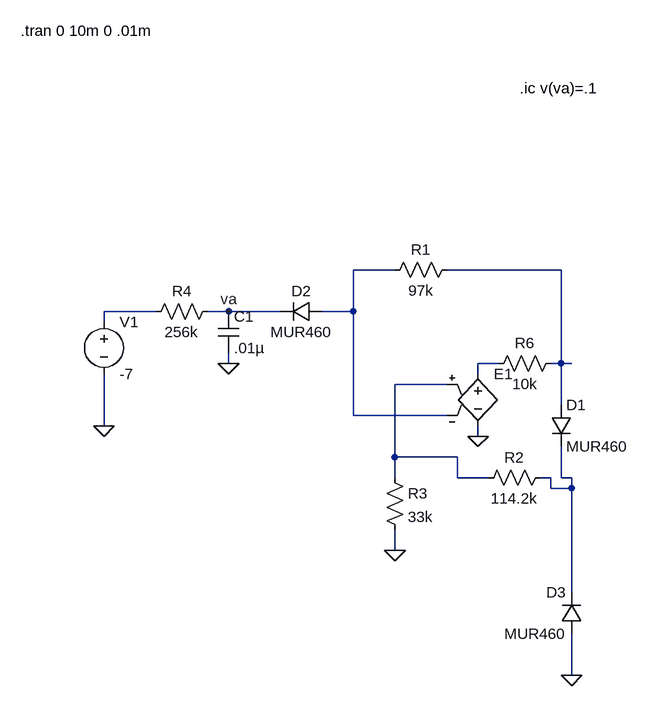
[diagram p0: schematic oper.asc]
oper.asc, the LTspice schematic file:
Version 4
SHEET 1 1748 680
WIRE 720 -80 656 -80
WIRE 976 -80 800 -80
WIRE 352 -16 272 -16
WIRE 464 -16 432 -16
WIRE 544 -16 464 -16
WIRE 656 -16 656 -80
WIRE 656 -16 608 -16
WIRE 272 0 272 -16
WIRE 464 64 464 48
WIRE 880 64 848 64
WIRE 976 64 976 -80
WIRE 976 64 960 64
WIRE 992 64 976 64
WIRE 848 80 848 64
WIRE 800 96 720 96
WIRE 976 128 976 64
WIRE 656 144 656 -16
WIRE 800 144 656 144
WIRE 272 160 272 80
WIRE 848 176 848 160
WIRE 720 208 720 96
WIRE 816 208 720 208
WIRE 720 240 720 208
WIRE 816 240 816 208
WIRE 864 240 816 240
WIRE 960 240 944 240
WIRE 976 240 976 192
WIRE 992 240 976 240
WIRE 960 256 960 240
WIRE 992 256 992 240
WIRE 992 256 960 256
WIRE 720 352 720 320
WIRE 992 416 992 256
WIRE 992 544 992 480
FLAG 272 160 0
FLAG 720 352 0
FLAG 464 64 0
FLAG 464 -16 va
FLAG 992 544 0
FLAG 848 176 0
SYMBOL res 816 -96 R90
WINDOW 0 0 56 VBottom 2
WINDOW 3 32 56 VTop 2
SYMATTR InstName R1
SYMATTR Value 97k
SYMBOL res 960 224 R90
WINDOW 0 0 56 VBottom 2
WINDOW 3 32 56 VTop 2
SYMATTR InstName R2
SYMATTR Value 114.2k
SYMBOL res 704 224 R0
SYMATTR InstName R3
SYMATTR Value 33k
SYMBOL cap 448 -16 R0
SYMATTR InstName C1
SYMATTR Value .01µ
SYMBOL res 448 -32 R90
WINDOW 0 0 56 VBottom 2
WINDOW 3 32 56 VTop 2
SYMATTR InstName R4
SYMATTR Value 256k
SYMBOL voltage 272 -16 R0
WINDOW 123 0 0 Left 2
WINDOW 39 0 0 Left 2
SYMATTR InstName V1
SYMATTR Value -7
SYMBOL res 976 48 R90
WINDOW 0 0 56 VBottom 2
WINDOW 3 32 56 VTop 2
SYMATTR InstName R6
SYMATTR Value 10k
SYMBOL diode 1008 480 R180
WINDOW 0 24 64 Left 2
WINDOW 3 24 0 Left 2
SYMATTR InstName D3
SYMATTR Value MUR460
SYMATTR Description Zener Diode
SYMATTR Type zener
SYMBOL e 848 64 R0
WINDOW 3 24 96 Invisible 2
SYMATTR Value table=(-100,-15)(-50u,-15)(50u,15)(100,15)
SYMATTR InstName E1
SYMBOL diode 960 128 R0
SYMATTR InstName D1
SYMATTR Value MUR460
SYMBOL diode 608 -32 R90
WINDOW 0 0 32 VBottom 2
WINDOW 3 32 32 VTop 2
SYMATTR InstName D2
SYMATTR Value MUR460
TEXT 912 -360 Left 2 !.ic v(va)=.1
TEXT 144 -448 Left 2 !.tran 0 10m 0 .01m

The netlist it stands for:
* oper.asc
R1 N002 N001 97k
R2 N006 N005 114.2k
R3 N005 0 33k
C1 va 0 .01µ
R4 va N003 256k
V1 N003 0 -7
R6 N002 N004 10k
D3 0 N006 MUR460
E1 N004 0 N005 N001 table=(-100,-15)(-50u,-15)(50u,15)(100,15)
D1 N002 N006 MUR460
D2 N001 va MUR460
.model D D
.lib standard.dio
.ic v(va)=.1
.tran 0 10m 0 .01m
.backanno
.end